# EasyEDA Pro project bandolibre.eprj, schematic MainBoard

## Sheets
1 P1: Board Name: MainBoard; Create Date: 2026-05-26; Page Name: P1; Project Name: bandoneo; Schematic Name: MainBoard; Update Date: 2026-06-13; Company: Pierre Labatut; Page Size: A4; Version: V1.0
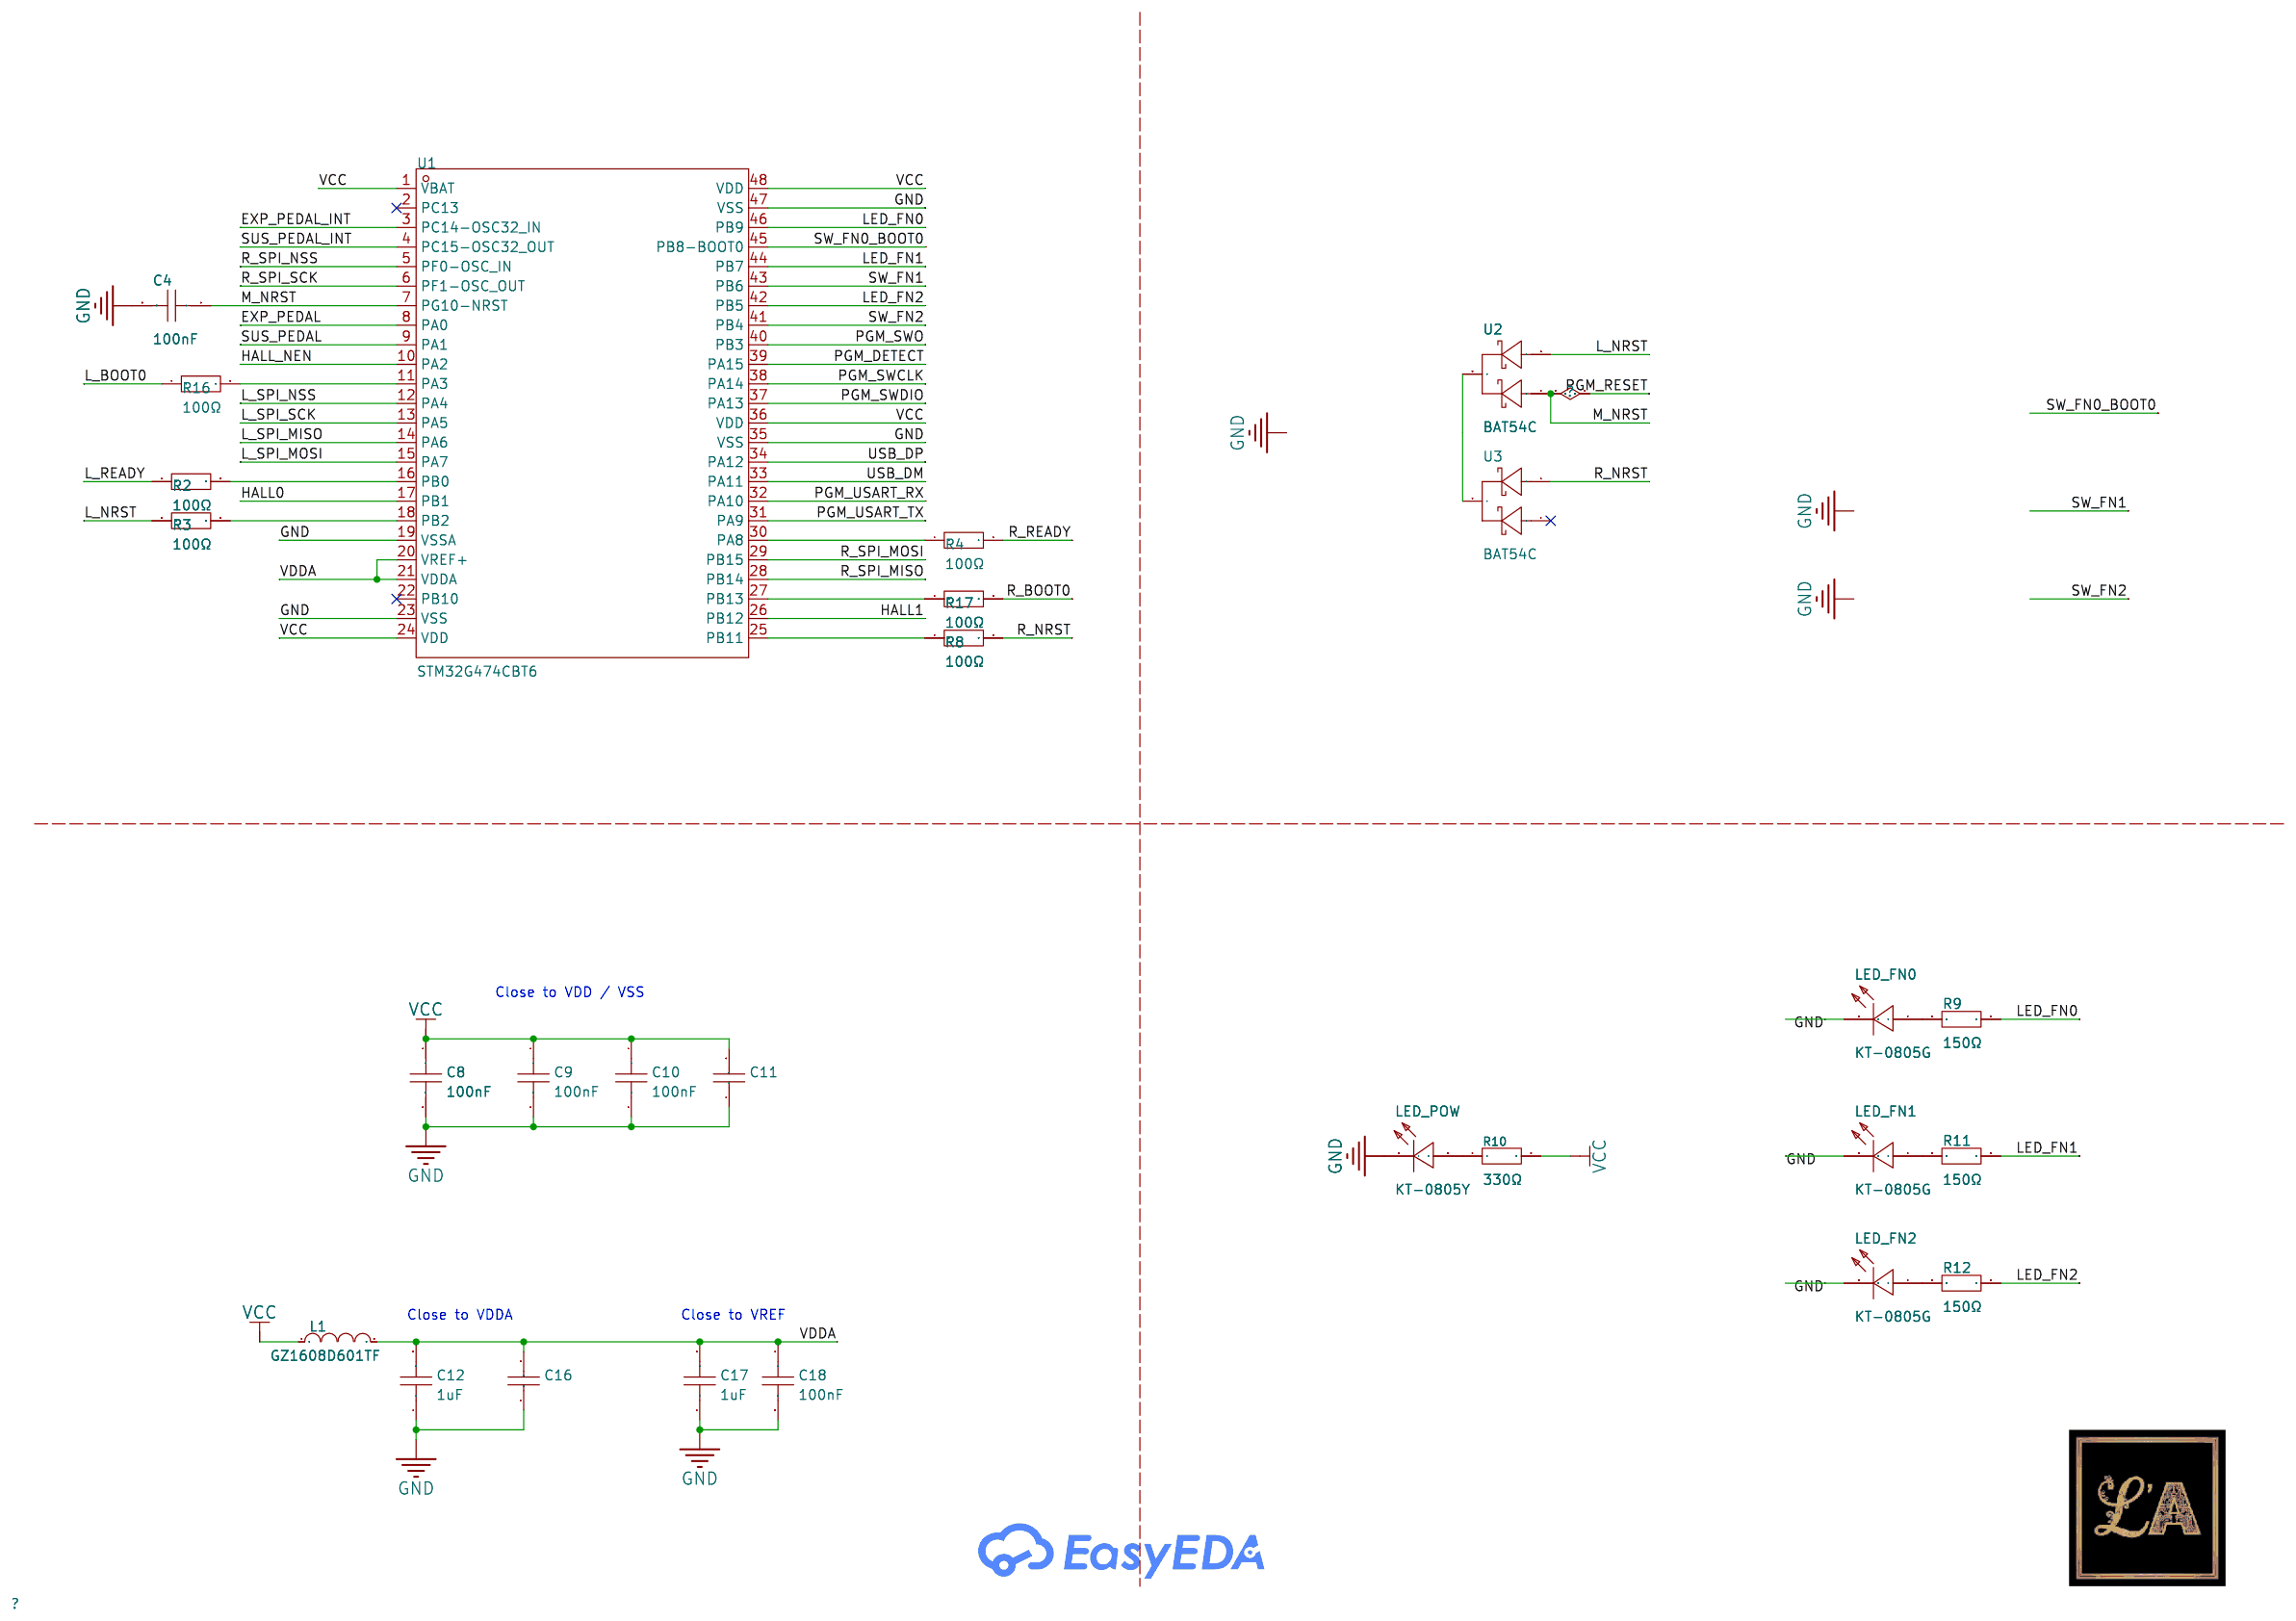
[diagram p3: P1]
2 P2: Page Name: P2; Version: v1.0-alpha
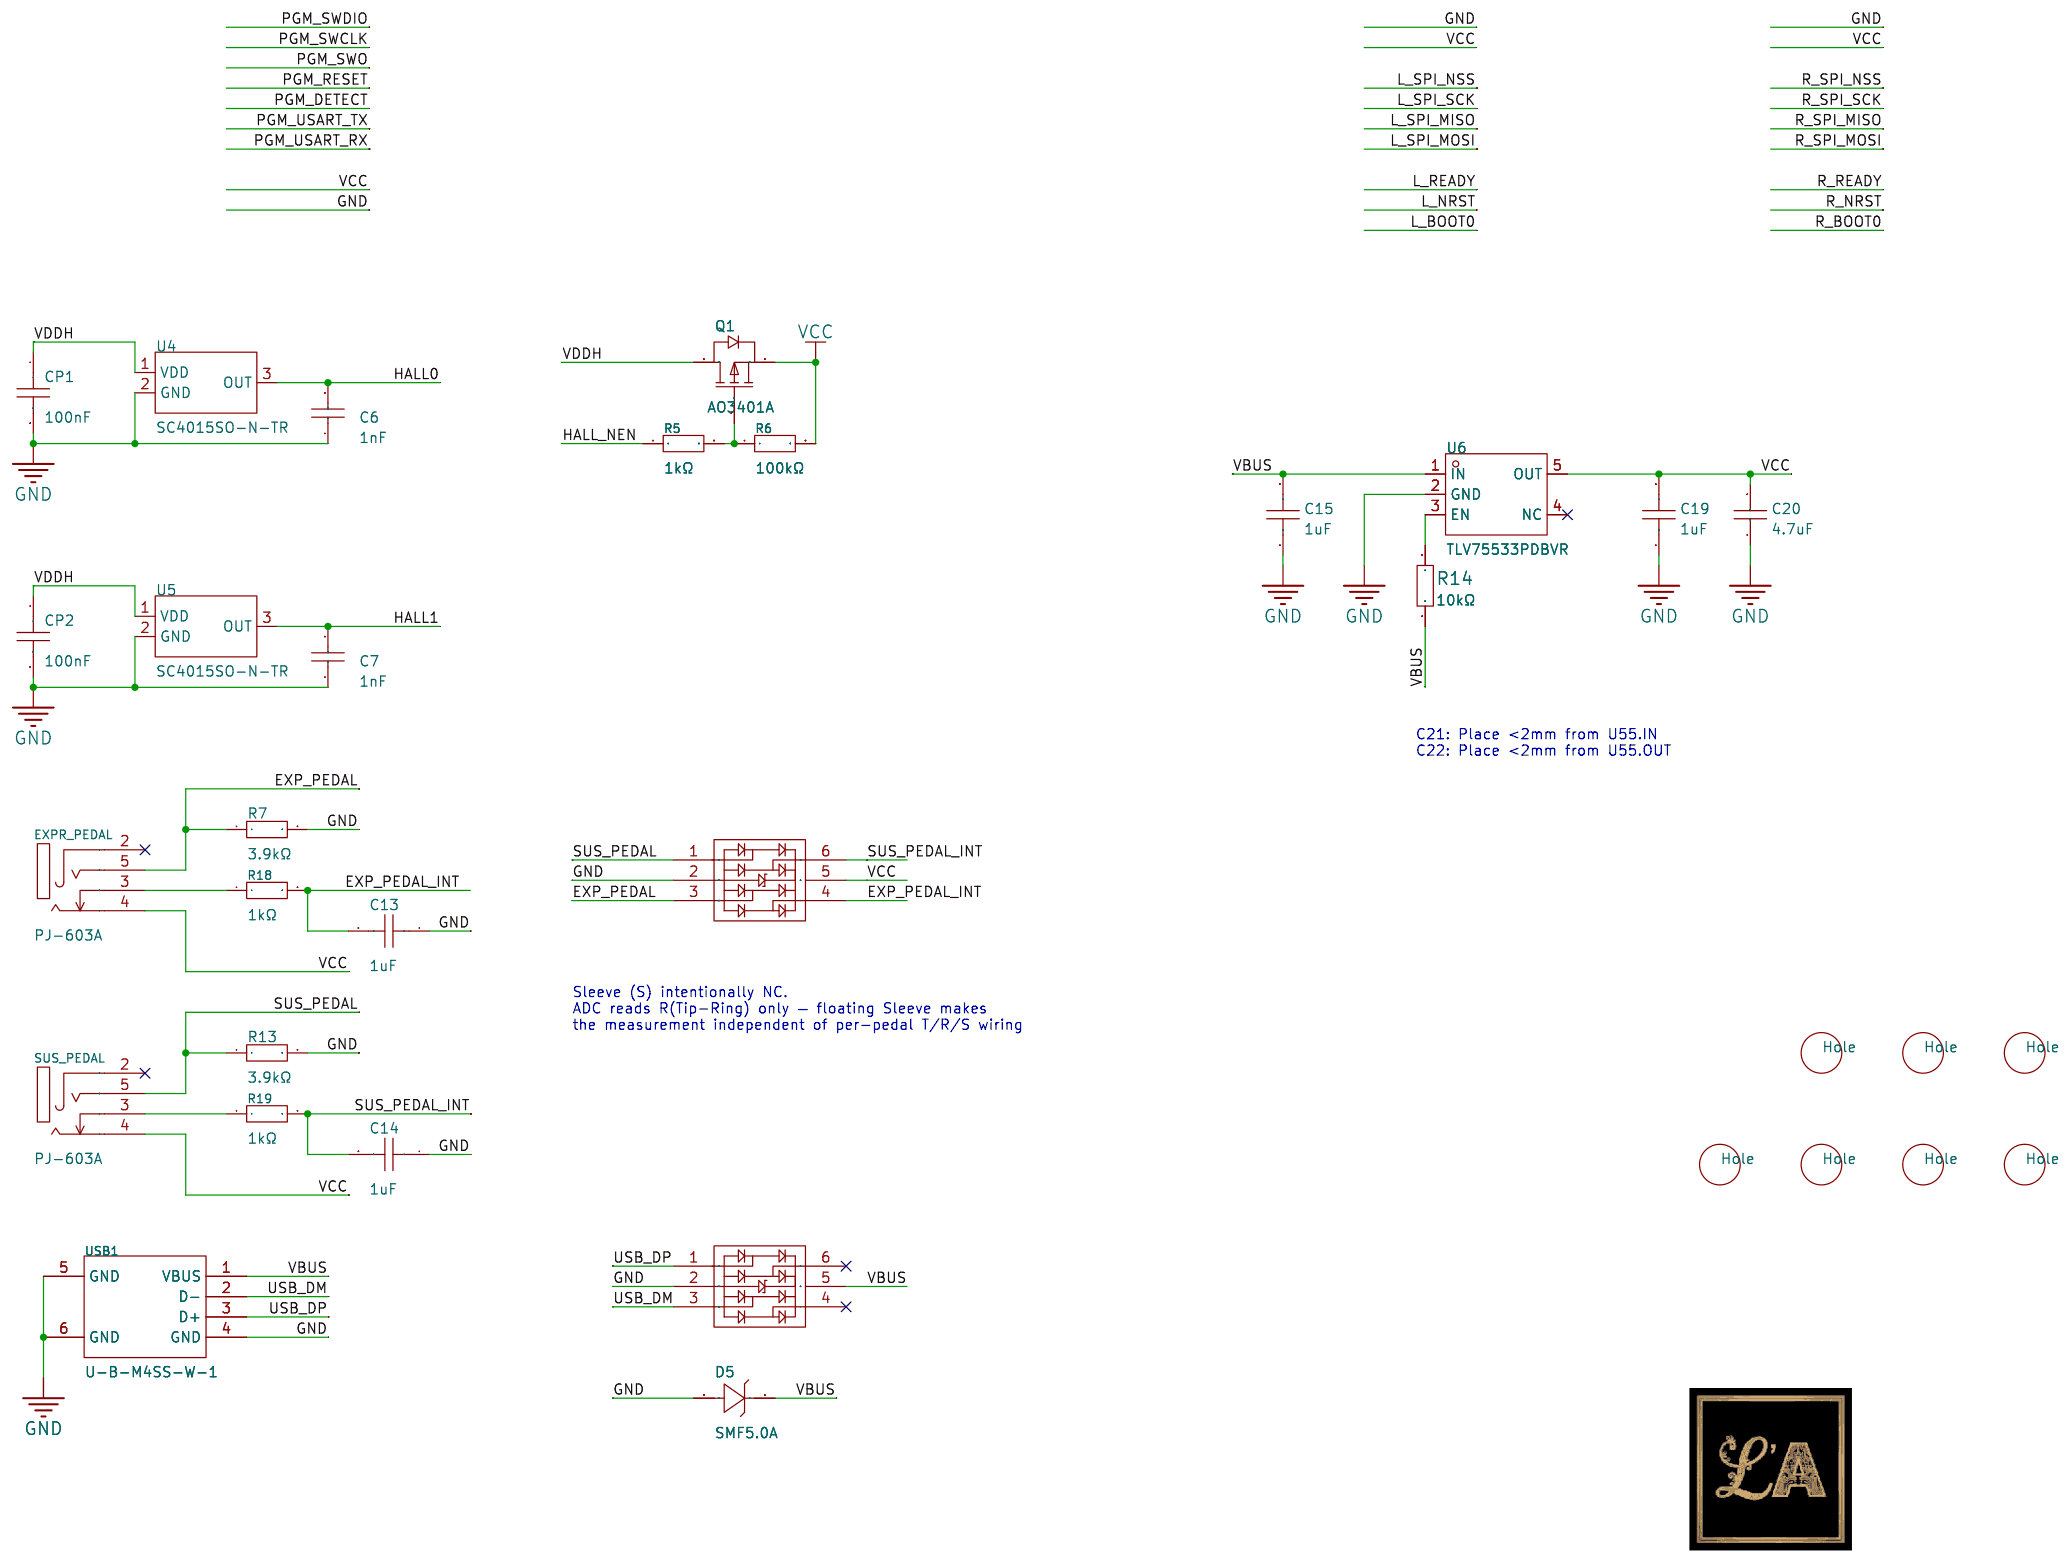
[diagram p4: P2]

## Parts
sheet P1
C4  100nF  [C0603]
C8  100nF  [C0402]
C9  100nF  [C0402]
C10  100nF  [C0402]
C11  4.7uF  [C0805]
C12  1uF  [C0402]
C16  10nF  [C0402]
C17  1uF  [C0402]
C18  100nF  [C0402]
CARTOUCHE1  -  [ABL_Cartouche]  (no BOM)
FN0  -
FN1  -
FN2  -
L1  GZ1608D601TF  [L0603]
LED_FN0  KT-0805G  [LED0805-R-RD]
LED_FN1  KT-0805G  [LED0805-R-RD]
LED_FN2  KT-0805G  [LED0805-R-RD]
LED_POW  KT-0805Y  [LED0805-R-RD]
R2  100Ω  [R0603]
R3  100Ω  [R0603]
R4  100Ω  [R0603]
R8  100Ω  [R0603]
R9  150Ω  [R0603]
R10  330Ω  [R0603]
R11  150Ω  [R0603]
R12  150Ω  [R0603]
R16  100Ω  [R0603]
R17  100Ω  [R0603]
RESET  -
U1  STM32G474CBT6  [LQFP-48_L7.0-W7.0-P0.50-LS9.0-BL]
U2  BAT54C  [SOT-23-3_L2.9-W1.3-P1.90-LS2.8-BR]
U3  BAT54C  [SOT-23-3_L2.9-W1.3-P1.90-LS2.8-BR]
sheet P2
C6  1nF  [C0603]
C7  1nF  [C0603]
C13  1uF  [C0603]
C14  1uF  [C0603]
C15  1uF  [C0603]
C19  1uF  [C0603]
C20  4.7uF  [C0805]
CBB1  -
CP1  100nF  [C0603]
CP2  100nF  [C0603]
D5  SMF5.0A  [SOD-123FL_L2.7-W1.8-LS3.8-RD]
EXPR_PEDAL  PJ-603A  [AUDIO-TH_PJ-603A]
H1  Hole  [HOLE_M3_H12]  (no BOM)
H2  Hole  [HOLE_M3_H12]  (no BOM)
H4  Hole  [HOLE_M3_H12]  (no BOM)
H5  Hole  [HOLE_M3_H12]  (no BOM)
H6  Hole  [HOLE_M3_H12]  (no BOM)
H7  Hole  [HOLE_M3_H12]  (no BOM)
H8  Hole  [HOLE_M3_H12]  (no BOM)
L_CBB1  -
Q1  AO3401A  [SOT-23_L2.9-W1.3-P1.90-LS2.4-BR]
R5  1kΩ  [R0603]
R6  100kΩ  [R0603]
R7  3.9kΩ  [R0603]
R13  3.9kΩ  [R0603]
R14  10kΩ  [R0603]
R18  1kΩ  [R0603]
R19  1kΩ  [R0603]
R_CBB2  -
SUS_PEDAL  PJ-603A  [AUDIO-TH_PJ-603A]
TV7  SRV05-4-P-T7  [SOT-23-6_L2.9-W1.6-P0.95-LS2.8-BR]
TV8  SRV05-4-P-T7  [SOT-23-6_L2.9-W1.6-P0.95-LS2.8-BR]
U4  SC4015SO-N-TR  [SOT-23-3_L2.9-W1.6-P1.90-LS2.8-BR-CW]
U5  SC4015SO-N-TR  [SOT-23-3_L2.9-W1.6-P1.90-LS2.8-BR-CW]
U6  TLV75533PDBVR  [SOT-23-5_L3.0-W1.7-P0.95-LS2.8-BR]
USB1  U-B-M4SS-W-1  [USB-B-SMD_U-B-M4SS-W-1]

## Library data of the parts
C4 CP1 CP2 = CC0603KRX7R9BB104: Capacitance: Tolerance:±10% Tolerance:±10% Voltage Rated: Temperature Coefficient:; LCSC Part Name: 100nF ±10% 50V; Supplier Part: C14663; Manufacturer: YAGEO(国巨); Supplier Footprint: 0603; JLCPCB Part Class: Basic Part; Datasheet: https://atta.szlcsc.com/upload/public/pdf/source/20170116/1484561234239.pdf; Supplier: LCSC; Tolerance: ±10%; Check: true
C8-C10 C18 = CL05B104KO5NNNC: Capacitance: Tolerance:±10% Tolerance:±10% Voltage Rated: Temperature Coefficient:; LCSC Part Name: 100nF ±10% 16V; Supplier Part: C1525; Manufacturer: SAMSUNG(三星); Supplier Footprint: 0402; JLCPCB Part Class: Basic Part; Datasheet: https://atta.szlcsc.com/upload/public/pdf/source/20160218/1457707763339.pdf; Supplier: LCSC; Tolerance: ±10%; Check: true
C11 C20 = CL21A475KAQNNNE: Capacitance:4.7uF Tolerance:±10% Tolerance:±10% Voltage Rating:25V Temperature Coefficient:X5R; LCSC Part Name: 4.7uF ±10% 25V; Supplier Part: C1779; Manufacturer: SAMSUNG(三星); Supplier Footprint: 0805; JLCPCB Part Class: Basic Part; Datasheet: https://item.szlcsc.com/datasheet/CL21A475KAQNNNE/2131.html; Supplier: LCSC; Tolerance: ±10%; Voltage Rating: 25V; Temperature Coefficient: X5R; Check: true
C12 C17 = CL05A105KA5NQNC: Capacitance: Tolerance:±10% Tolerance:±10% Voltage Rated: Temperature Coefficient:; LCSC Part Name: 1uF ±10% 25V; Supplier Part: C52923; Manufacturer: SAMSUNG(三星); Supplier Footprint: 0402; JLCPCB Part Class: Basic Part; Datasheet: https://atta.szlcsc.com/upload/public/pdf/source/20160218/1457707763339.pdf; Supplier: LCSC; Tolerance: ±10%; Check: true
C16 = CL05B103KB5NNNC: Capacitance: Tolerance:±10% Tolerance:±10% Voltage Rated: Temperature Coefficient:; LCSC Part Name: 10nF ±10% 50V; Supplier Part: C15195; Manufacturer: SAMSUNG(三星); Supplier Footprint: 0402; JLCPCB Part Class: Basic Part; Datasheet: https://atta.szlcsc.com/upload/public/pdf/source/20160218/1457707763339.pdf; Supplier: LCSC; Tolerance: ±10%; Check: true
CARTOUCHE1 = ABL_Cartouche: Design Version: v1.0-alpha; Design Name: Bandolibre Main Board
L1 = GZ1608D601TF: Impedance @ Frequency:600Ω@100MHz Tolerance:±25% Tolerance:±25% DC Resistance(DCR):450mΩ Current Rating:200mA Number of Circuits:1 Operating Temperature:-55℃~+125℃ Operating Temperature:-55℃~+125℃; LCSC Part Name: 单路 0603磁珠 阻抗600Ω@100MHz; Supplier Part: C1002; Manufacturer: Sunlord(顺络); Supplier Footprint: 0603; JLCPCB Part Class: Basic Part; Datasheet: https://item.szlcsc.com/datasheet/GZ1608D601TF/1354.html; Supplier: LCSC; Impedance @ Frequency: 600Ω@100MHz; Tolerance: ±25%; DC Resistance(DCR): 450mΩ; Current Rating: 200mA; Number of Circuits: 1; Operating Temperature: -55℃~+125℃; Check: true
LED_FN0-LED_FN2 = KT-0805G: Lamp Holder Type:- Illumination Color:Emerald Green Voltage - Forward(Vf):2.6V~3.1V Voltage - Forward(Vf):2.6V~3.1V Power(Watts):100mW Forward Current:5mA Wavelength - Dominant:513nm~528nm Wavelength - Dominant:513nm~528nm Peak Wavelength:525nm Diode Conf; LCSC Part Name: 0805 翠绿 高亮; Supplier Part: C2297; Manufacturer: KENTO; Supplier Footprint: 0805; JLCPCB Part Class: Basic Part; Datasheet: https://item.szlcsc.com/datasheet/KT-0805G/2670.html; Supplier: LCSC; Illumination Color: Emerald Green; Voltage - Forward(Vf): 2.6V~3.1V; Power(Watts): 100mW; Forward Current: 5mA; Wavelength - Dominant: 513nm~528nm; Peak Wavelength: 525nm; Luminous Intensity: 430mcd; Viewing Angle: 120°; Operating Temperature: -40℃~+85℃
LED_POW = KT-0805Y: Illumination Color:Yellow Voltage - Forward(Vf):1.8V~2.4V Voltage - Forward(Vf):1.8V~2.4V Power(Watts):40mW Forward Current:- Wavelength - Dominant:584nm~594nm Wavelength - Dominant:584nm~594nm Peak Wavelength:596nm Diode Configuration:- Lens Color:Water; LCSC Part Name: 0805 黄灯 高亮; Supplier Part: C2296; Manufacturer: KENTO; Supplier Footprint: 0805; JLCPCB Part Class: Basic Part; Datasheet: https://item.szlcsc.com/datasheet/KT-0805Y/2669.html; Supplier: LCSC; Illumination Color: Yellow; Voltage - Forward(Vf): 1.8V~2.4V; Power(Watts): 40mW; Wavelength - Dominant: 584nm~594nm; Peak Wavelength: 596nm; Lens Color: Water Clear; Luminous Intensity: 175mcd; Viewing Angle: 120°; Operating Temperature: -40℃~+85℃; Check: true
R2-R4 R8 R16 R17 = 0603WAF1000T5E: Type:Thick Film Resistors Resistance: Tolerance:±1% Tolerance:±1% Power(Watts): Overload Voltage (Max): Temperature Coefficient:±200ppm/℃ Temperature Coefficient:±200ppm/℃ Operating Temperature Range:-55℃~+155℃ Operating Temperature Range:-55℃~+155℃; LCSC Part Name: 100Ω ±1% 100mW 厚膜电阻; Supplier Part: C22775; Manufacturer: UNI-ROYAL(厚声); Supplier Footprint: 0603; JLCPCB Part Class: Basic Part; Datasheet: https://atta.szlcsc.com/upload/public/pdf/source/20200306/C422600_1E6D84923E4A46A82E41ADD87F860B5C.pdf; Supplier: LCSC; Type: Thick Film Resistors; Tolerance: ±1%; Temperature Coefficient: ±200ppm/℃; Operating Temperature Range: -55℃~+155℃; Check: true
R9 R11 R12 = 0603WAF1500T5E: Type:Thick Film Resistors Resistance: Tolerance:±1% Tolerance:±1% Power(Watts): Overload Voltage (Max): Temperature Coefficient:±100ppm/℃ Temperature Coefficient:±100ppm/℃ Operating Temperature Range:-55℃~+155℃ Operating Temperature Range:-55℃~+155℃; LCSC Part Name: 150Ω ±1% 100mW 厚膜电阻; Supplier Part: C22808; Manufacturer: UNI-ROYAL(厚声); Supplier Footprint: 0603; JLCPCB Part Class: Basic Part; Datasheet: https://atta.szlcsc.com/upload/public/pdf/source/20200306/C422600_1E6D84923E4A46A82E41ADD87F860B5C.pdf; Supplier: LCSC; Type: Thick Film Resistors; Tolerance: ±1%; Temperature Coefficient: ±100ppm/℃; Operating Temperature Range: -55℃~+155℃
R10 = 0603WAF3300T5E: Type:Thick Film Resistors Resistance: Tolerance:±1% Tolerance:±1% Power(Watts): Overload Voltage (Max): Temperature Coefficient:±100ppm/℃ Temperature Coefficient:±100ppm/℃ Operating Temperature Range:-55℃~+155℃ Operating Temperature Range:-55℃~+155℃; LCSC Part Name: 330Ω ±1% 100mW 厚膜电阻; Supplier Part: C23138; Manufacturer: UNI-ROYAL(厚声); Supplier Footprint: 0603; JLCPCB Part Class: Basic Part; Datasheet: https://atta.szlcsc.com/upload/public/pdf/source/20200306/C422600_1E6D84923E4A46A82E41ADD87F860B5C.pdf; Supplier: LCSC; Type: Thick Film Resistors; Tolerance: ±1%; Temperature Coefficient: ±100ppm/℃; Operating Temperature Range: -55℃~+155℃
U1 = STM32G474CBT6: CPU Core:ARM Cortex-M4F CPU Maximum Speed:170MHz Core Size:32 Bit Program Storage Size:128KB Program Memory Type:FLASH RAM Size:128KB EEPROM:- Number of I/O:38 ADC (Bit):12bit DAC (Bit):12bit Oscillator Type:Built-in Voltage - Supply:1.71V~3.6V Voltage -; LCSC Part Name: Arm Cortex-M4 32位MCU+FPU，170 MHz/213 DMIPS，128 KB SRAM，丰富的模拟功能、数学加速器，184 ps 12通道高分辨率定时器; Supplier Part: C730123; Manufacturer: ST(意法半导体); Supplier Footprint: LQFP-48(7x7); JLCPCB Part Class: Extended Part; Datasheet: https://item.szlcsc.com/datasheet/STM32G474CBT6/778078.html; Supplier: LCSC; CPU Core: ARM Cortex-M4F; CPU Maximum Speed: 170MHz; Core Size: 32 Bit; Program Storage Size: 128KB; Program Memory Type: FLASH; RAM Size: 128KB; Number of I/O: 38; ADC (Bit): 12bit; DAC (Bit): 12bit; Oscillator Type: Built-in; Voltage - Supply: 1.71V~3.6V; Operating Temperature: -40℃~+85℃; Check: true
U2 U3 = BAT54C_C22466350: Diode Configuration:1 Pair Common Cathode Voltage - Forward(Vf@If):1V@100mA Voltage - DC Reverse(Vr):30V Current - Rectified:200mA Reverse Leakage Current (Ir):2uA@25V Operating Junction Temperature Range:- Operating Junction Temperature Range:- Non-Repet; LCSC Part Name: 电压:30V 电流:0.2A; Supplier Part: C22466350; Manufacturer: R+O(宏嘉诚); Supplier Footprint: SOT-23; JLCPCB Part Class: Extended Part; Datasheet: https://item.szlcsc.com/datasheet/BAT54C/24165509.html; Supplier: LCSC; Diode Configuration: 1 Pair Common Cathode; Voltage - Forward(Vf@If): 1V@100mA; Voltage - DC Reverse(Vr): 30V; Current - Rectified: 200mA; Reverse Leakage Current (Ir): 2uA@25V; Non-Repetitive Peak Forward Surge Current: 600mA; Check: true
C6 C7 = CL10B102KB8NNNC: Capacitance:1nF Tolerance:±10% Tolerance:±10% Voltage Rating:50V Temperature Coefficient:X7R; LCSC Part Name: 1nF ±10% 50V; Supplier Part: C1588; Manufacturer: SAMSUNG(三星); Supplier Footprint: 0603; JLCPCB Part Class: Basic Part; Datasheet: https://item.szlcsc.com/datasheet/CL10B102KB8NNNC/1940.html; Supplier: LCSC; Tolerance: ±10%; Voltage Rating: 50V; Temperature Coefficient: X7R; Check: true
C13 C14 = CL10A105KB8NNNC: Capacitance:1uF Tolerance:±10% Tolerance:±10% Voltage Rating:50V Temperature Coefficient:X5R; LCSC Part Name: 1uF ±10% 50V; Supplier Part: C15849; Manufacturer: SAMSUNG(三星); Supplier Footprint: 0603; JLCPCB Part Class: Basic Part; Datasheet: https://item.szlcsc.com/datasheet/CL10A105KB8NNNC/16531.html; Supplier: LCSC; Tolerance: ±10%; Voltage Rating: 50V; Temperature Coefficient: X5R
C15 C19 = CL10A105KB8NNNC: Temperature Coefficient: Tolerance: Tolerance: Voltage Rated: Capacitance:; LCSC Part Name: 1uF(105) ±10% 50V; Supplier Part: C15849; Manufacturer: SAMSUNG(三星); Supplier Footprint: 0603; JLCPCB Part Class: Basic Part; Datasheet: https://atta.szlcsc.com/upload/public/pdf/source/20160103/1457707679084.pdf; Supplier: LCSC; Check: true
D5 = SMF5.0A_C19077497: Polarity:Unidirectional Reverse Stand-Off Voltage (Vrwm):5V Clamping Voltage:9.2V Peak Pulse Current (Ipp):21.7A@10/1000us Peak Pulse Power Dissipation (Ppp):200W@10/1000us Voltage - Breakdown:7V Reverse Leakage Current (Ir):400uA Number of Channels:1 Ope; LCSC Part Name: 单向TVS 5V截止 峰值浪涌电流：21.7A@10/1000us; Supplier Part: C19077497; Manufacturer: R+O(宏嘉诚); Supplier Footprint: SOD-123FL; JLCPCB Part Class: Extended Part; Datasheet: https://item.szlcsc.com/datasheet/SMF5.0A/20275582.html; Supplier: LCSC; Polarity: Unidirectional; Reverse Stand-Off Voltage (Vrwm): 5V; Clamping Voltage: 9.2V; Peak Pulse Current (Ipp): 21.7A@10/1000us; Peak Pulse Power Dissipation (Ppp): 200W@10/1000us; Voltage - Breakdown: 7V; Reverse Leakage Current (Ir): 400uA; Number of Channels: 1; Operating Temperature: -55℃~+150℃; level of protection: IEC 61000-4-2; Type: TVS; Check: true
EXPR_PEDAL SUS_PEDAL = PJ-603A: Connector Type:6.35mm Headphone Jack Current Rating:500mA Voltage Rating (Max):30V Contact Material:Brass Contact Plating:Silver Operating Temperature:-20℃~+70℃ Operating Temperature:-20℃~+70℃; LCSC Part Name: 三件套 6.35mm耳机座; Supplier Part: C309273; Manufacturer: HOOYA(皓宇电子); Supplier Footprint: 插件; JLCPCB Part Class: Extended Part; Datasheet: https://item.szlcsc.com/datasheet/PJ-603A/292934.html; Supplier: LCSC; Connector Type: 6.35mm Headphone Jack; Current Rating: 500mA; Voltage Rating (Max): 30V; Contact Material: Brass; Contact Plating: Silver; Operating Temperature: -20℃~+70℃; Check: true
H1 H2 H4-H8 = HOLE_M3_H12: Hole for fine adjustment.; Check: true
L_CBB1 = -: Comment: LEFT_WING_CONNECTOR
Q1 = AO3401A_C15127: Number:1 P-Channel Drain to Source Voltage:30V Current - Continuous Drain(Id):4A RDS(on):47mΩ@10V；85mΩ@2.5V；60mΩ@4.5V Pd - Power Dissipation:- Gate Threshold Voltage (Vgs(th)):900mV Gate Charge(Qg):14nC@10V Input Capacitance(Ciss):645pF Reverse Transfer C; LCSC Part Name: 1个P沟道 耐压:30V 电流:4A; Supplier Part: C15127; Manufacturer: AOS; Supplier Footprint: SOT-23; JLCPCB Part Class: Basic Part; Datasheet: https://item.szlcsc.com/datasheet/AO3401A/15801.html; Supplier: LCSC; Number: 1 P-Channel; Drain to Source Voltage: 30V; Current - Continuous Drain(Id): 4A; RDS(on): 47mΩ@10V；85mΩ@2.5V；60mΩ@4.5V; Gate Threshold Voltage (Vgs(th)): 900mV; Gate Charge(Qg): 14nC@10V; Input Capacitance(Ciss): 645pF; Reverse Transfer Capacitance (Crss@Vds): 55pF; Output Capacitance(Coss): 80pF; Check: true
R5 R18 R19 = 0603WAF1001T5E: Type:Thick Film Resistor Resistance:1kΩ Tolerance:±1% Tolerance:±1% Power(Watts):100mW Voltage-Supply(Max):75V Temperature Coefficient:±100ppm/℃ Temperature Coefficient:±100ppm/℃ Operating Temperature:-55℃~+155℃ Operating Temperature:-55℃~+155℃; LCSC Part Name: 1kΩ ±1% 100mW 厚膜电阻; Supplier Part: C21190; Manufacturer: UNI-ROYAL(厚声); Supplier Footprint: 0603; JLCPCB Part Class: Basic Part; Datasheet: https://item.szlcsc.com/datasheet/0603WAF1001T5E/21904.html; Supplier: LCSC; Type: Thick Film Resistor; Tolerance: ±1%; Power(Watts): 100mW; Voltage-Supply(Max): 75V; Temperature Coefficient: ±100ppm/℃; Operating Temperature: -55℃~+155℃; Check: true
R6 = 0603WAF1003T5E: Type:Thick Film Resistors Resistance: Tolerance:±1% Tolerance:±1% Power(Watts): Temperature Coefficient:±100ppm/℃ Temperature Coefficient:±100ppm/℃ Overload Voltage (Max): Operating Temperature Range:-55℃~+155℃ Operating Temperature Range:-55℃~+155℃; LCSC Part Name: 100kΩ ±1% 100mW; Supplier Part: C25803; Manufacturer: UNI-ROYAL(厚声); Supplier Footprint: 0603; JLCPCB Part Class: Basic Part; Datasheet: https://atta.szlcsc.com/upload/public/pdf/source/20200306/C422600_1E6D84923E4A46A82E41ADD87F860B5C.pdf; Supplier: LCSC; Type: Thick Film Resistors; Tolerance: ±1%; Temperature Coefficient: ±100ppm/℃; Operating Temperature Range: -55℃~+155℃; Check: true
R7 R13 = 0603WAF3901T5E: Type:Thick Film Resistor Resistance:3.9kΩ Tolerance:±1% Tolerance:±1% Power(Watts):100mW Voltage-Supply(Max):75V Temperature Coefficient:±100ppm/℃ Temperature Coefficient:±100ppm/℃ Operating Temperature:-55℃~+155℃ Operating Temperature:-55℃~+155℃; LCSC Part Name: 3.9kΩ ±1% 100mW 厚膜电阻; Supplier Part: C23018; Manufacturer: UNI-ROYAL(厚声); Supplier Footprint: 0603; JLCPCB Part Class: Basic Part; Datasheet: https://item.szlcsc.com/datasheet/0603WAF3901T5E/23745.html; Supplier: LCSC; Type: Thick Film Resistor; Tolerance: ±1%; Power(Watts): 100mW; Voltage-Supply(Max): 75V; Temperature Coefficient: ±100ppm/℃; Operating Temperature: -55℃~+155℃; Check: true
R14 = 0603WAF1002T5E: Type:Thick Film Resistor Resistance:10kΩ Tolerance:±1% Tolerance:±1% Power(Watts):100mW Voltage-Supply(Max):75V Temperature Coefficient:±100ppm/℃ Temperature Coefficient:±100ppm/℃ Operating Temperature:-55℃~+155℃ Operating Temperature:-55℃~+155℃; LCSC Part Name: 厚膜电阻 10kΩ ±1% 100mW; Supplier Part: C25804; Manufacturer: UNI-ROYAL(厚声); Supplier Footprint: 0603; JLCPCB Part Class: Basic Part; Datasheet: https://item.szlcsc.com/datasheet/0603WAF1002T5E/26547.html; Supplier: LCSC; Type: Thick Film Resistor; Tolerance: ±1%; Power(Watts): 100mW; Voltage-Supply(Max): 75V; Temperature Coefficient: ±100ppm/℃; Operating Temperature: -55℃~+155℃; Check: true
R_CBB2 = -: Comment: RIGHT_WING_CONNECTOR
TV7 TV8 = SRV05-4-P-T7_C85364: Reverse Stand-Off Voltage (Vrwm):5V Clamping Voltage:12V Peak Pulse Current (Ipp):1A@8/20us Voltage - Breakdown:6V Type:TVS; Supplier Part: C85364; Manufacturer: PROTEK; Supplier Footprint: SOT-23-6; JLCPCB Part Class: Extended Part; Datasheet: https://atta.szlcsc.com/upload/public/pdf/source/20161024/1477288764689.pdf; Supplier: LCSC; Reverse Stand-Off Voltage (Vrwm): 5V; Clamping Voltage: 12V; Peak Pulse Current (Ipp): 1A@8/20us; Voltage - Breakdown: 6V; Type: TVS; Check: true
U4 U5 = SC4015SO-N-TR: Magnetic Field Range:±100mT Magnetic Field Range:±100mT Sensitivity:3.9mV/Gs Voltage - Supply:2.5V~5.5V Voltage - Supply:2.5V~5.5V Supply Current:2.5mA Operating Temperature:-40℃~+105℃ Operating Temperature:-40℃~+105℃; LCSC Part Name: 线性霍尔; Supplier Part: C49363171; Manufacturer: Semiment(赛卓); Supplier Footprint: SOT23-3L; JLCPCB Part Class: Extended Part; Datasheet: https://item.szlcsc.com/datasheet/SC4015SO-N-TR/51868409.html; Supplier: LCSC; Magnetic Field Range: ±100mT; Sensitivity: 3.9mV/Gs; Voltage - Supply: 2.5V~5.5V; Supply Current: 2.5mA; Operating Temperature: -40℃~+105℃; Check: true
U6 = TLV75533PDBVR: Output Type:Fixed Voltage - Supply:5.5V Output Voltage:3.3V Output Voltage:3.3V Output Current:500mA Power Supply Rejection Ratio (PSRR):46dB@(100kHz) Voltage Dropout:238mV@(500mA) standby current:25uA Noise:71.5uVrms Features:Under Voltage Lockout；Soft S; LCSC Part Name: 3.3V 500mA 5.5V; Supplier Part: C404027; Manufacturer: TI(德州仪器); Supplier Footprint: SOT-23-5; JLCPCB Part Class: Extended Part; Datasheet: https://www.ti.com/cn/lit/gpn/tlv755p; Supplier: LCSC; Output Type: Fixed; Voltage - Supply: 5.5V; Output Voltage: 3.3V; Output Current: 500mA; Power Supply Rejection Ratio (PSRR): 46dB@(100kHz); Voltage Dropout: 238mV@(500mA); standby current: 25uA; Noise: 71.5uVrms; Features: Under Voltage Lockout；Soft Start；Over Temperature Protection；Over Current Protection; Operating Temperature: -40℃~+125℃@(Tj); Output Configuration: Positive; Number of Outputs: 1; Check: true
USB1 = U-B-M4SS-W-1: Connector Type:Type-B Protocol Standard:USB 2.0 Gender:Female Mounting Type:Surface Mount, Right Angle Number of Contacts:4P Number of Ports:1 Current Rating-Power:1A Voltage Rating:30V Detection color:Black Operating Temperature:-20℃~+60℃ Operating Tempe; LCSC Part Name: Type-B 母 卧贴; Supplier Part: C530599; Manufacturer: 韩国韩荣; Supplier Footprint: SMD; JLCPCB Part Class: Extended Part; Datasheet: https://item.szlcsc.com/datasheet/U-B-M4SS-W-1/550933.html; Supplier: LCSC; Connector Type: Type-B; Protocol Standard: USB 2.0; Gender: Female; Mounting Type: Surface Mount, Right Angle; Number of Contacts: 4P; Number of Ports: 1; Current Rating-Power: 1A; Voltage Rating: 30V; Detection color: Black; Operating Temperature: -20℃~+60℃; Check: true

## Nets
GND: C4.1 C4.2 C6.1 C7.1 C8.1 C8.2 C9.1 C9.2 C10.1 C10.2 C11.1 C11.2 C12.1 C13.1 C14.1 C15.1 C16.1 C17.1 C18.2 C19.1 C19.2 C20.1 C20.2 CBB1.(GND) CP1.2 CP2.2 D5.2(A) EXPR_PEDAL.4 FN1.(OUT) FN2.(OUT) L1.1 LED_FN0.2(K) LED_FN1.2(K) LED_FN2.2(K) LED_POW.2(-) Q1.2(S) R6.2 R7.2 R10.2 R13.2 RESET.(OUT) SUS_PEDAL.4 TV7.2 TV7.5 TV8.2 U1.1(VBAT) U1.7(PG10-NRST) U1.19(VSSA) U1.23(VSS) U1.24(VDD) U1.31(PA9) U1.32(PA10) U1.35(VSS) U1.36(VDD) U1.37(PA13) U1.38(PA14) U1.39(PA15) U1.40(PB3) U1.41(PB4) U1.43(PB6) U1.47(VSS) U1.48(VDD) U2.1(A) U2.3(K) U3.3(K) U4.2(GND) U5.2(GND) U6.2(GND) U6.5(OUT) USB1.4(GND) USB1.5(GND) USB1.6(GND)
VBUS: C15.2 D5.1(K) R14.1 TV8.5 U6.1(IN) USB1.1(VBUS)
VDDA: C12.2 C16.2 C17.2 C18.1 L1.2 U1.20(VREF+) U1.21(VDDA)
VDDH: CP1.1 CP2.1 Q1.3(D) U4.1(VDD) U5.1(VDD)
EXP_PEDAL: EXPR_PEDAL.5 R7.1 TV7.3 U1.8(PA0)
EXP_PEDAL_INT: C13.2 R18.2 TV7.4 U1.3(PC14-OSC32_IN)
HALL0: C6.2 U1.17(PB1) U4.3(OUT)
HALL1: C7.2 U1.26(PB12) U5.3(OUT)
HALL_NEN: R5.1 U1.10(PA2)
L_BOOT0: R16.1
L_NRST: R3.1 U2.2(A)
L_READY: R2.1
L_SPI_MISO: U1.14(PA6)
L_SPI_MOSI: U1.15(PA7)
L_SPI_NSS: U1.12(PA4)
L_SPI_SCK: U1.13(PA5)
LED_FN0: R9.1 U1.46(PB9)
LED_FN1: R11.1 U1.44(PB7)
LED_FN2: R12.1 U1.42(PB5)
R_BOOT0: R17.2
R_NRST: R8.2 U3.2(A)
R_READY: R4.2
R_SPI_MISO: U1.28(PB14)
R_SPI_MOSI: U1.29(PB15)
R_SPI_NSS: U1.5(PF0-OSC_IN)
R_SPI_SCK: U1.6(PF1-OSC_OUT)
SUS_PEDAL: R13.1 SUS_PEDAL.5 TV7.1 U1.9(PA1)
SUS_PEDAL_INT: C14.2 R19.2 TV7.6 U1.4(PC15-OSC32_OUT)
SW_FN0_BOOT0: FN0.(SW_BOOT) U1.45(PB8-BOOT0)
USB_DM: TV8.3 U1.33(PA11) USB1.2(D-)
USB_DP: TV8.1 U1.34(PA12) USB1.3(D+)
$1N59026: LED_POW.1(+) R10.1
$1N61072: R3.2 U1.18(PB2)
$1N61205: R2.2 U1.16(PB0)
$1N61211: R4.1 U1.30(PA8)
$1N62333: R8.1 U1.25(PB11)
$1N68331: R16.2 U1.11(PA3)
$1N68371: R17.1 U1.27(PB13)
$1N71155: LED_FN0.1(A) R9.2
$1N71201: LED_FN1.1(A) R11.2
$1N71247: LED_FN2.1(A) R12.2
$4N18954: R14.2 U6.3(EN)
$4N19863: Q1.1(G) R5.2 R6.1
$4N27011: R19.1 SUS_PEDAL.3
$4N27027: EXPR_PEDAL.3 R18.1

Not connected (* = marked no-connect by the designer): EXPR_PEDAL 2*; L_CBB1 1(GND) 2(VDD) 3(SPI_NSS) 4(SPI_SCK) 5(SPI_MISO) 6(SPI_MOSI) 7(READY) 8(NRST) 9(BOOT0); R_CBB2 1(GND) 2(VDD) 3(SPI_NSS) 4(SPI_SCK) 5(SPI_MISO) 6(SPI_MOSI) 7(READY) 8(NRST) 9(BOOT0); SUS_PEDAL 2*; TV8 4* 6*; U1 2(PC13)* 22(PB10)*; U3 1(A)*; U6 4(NC)*

## Notes on the sheets
sheet 1
- Close to VDD / VSS
- Close to VDDA
- Close to VREF
sheet 2
- C21: Place <2mm from U55.IN
  C22: Place <2mm from U55.OUT
- Sleeve (S) intentionally NC.
  ADC reads R(Tip-Ring) only — floating Sleeve makes
  the measurement independent of per-pedal T/R/S wiring
